# Altium project PROJECT-ESP32-S3-WROOM-1-BREAKOUT.PrjPcb
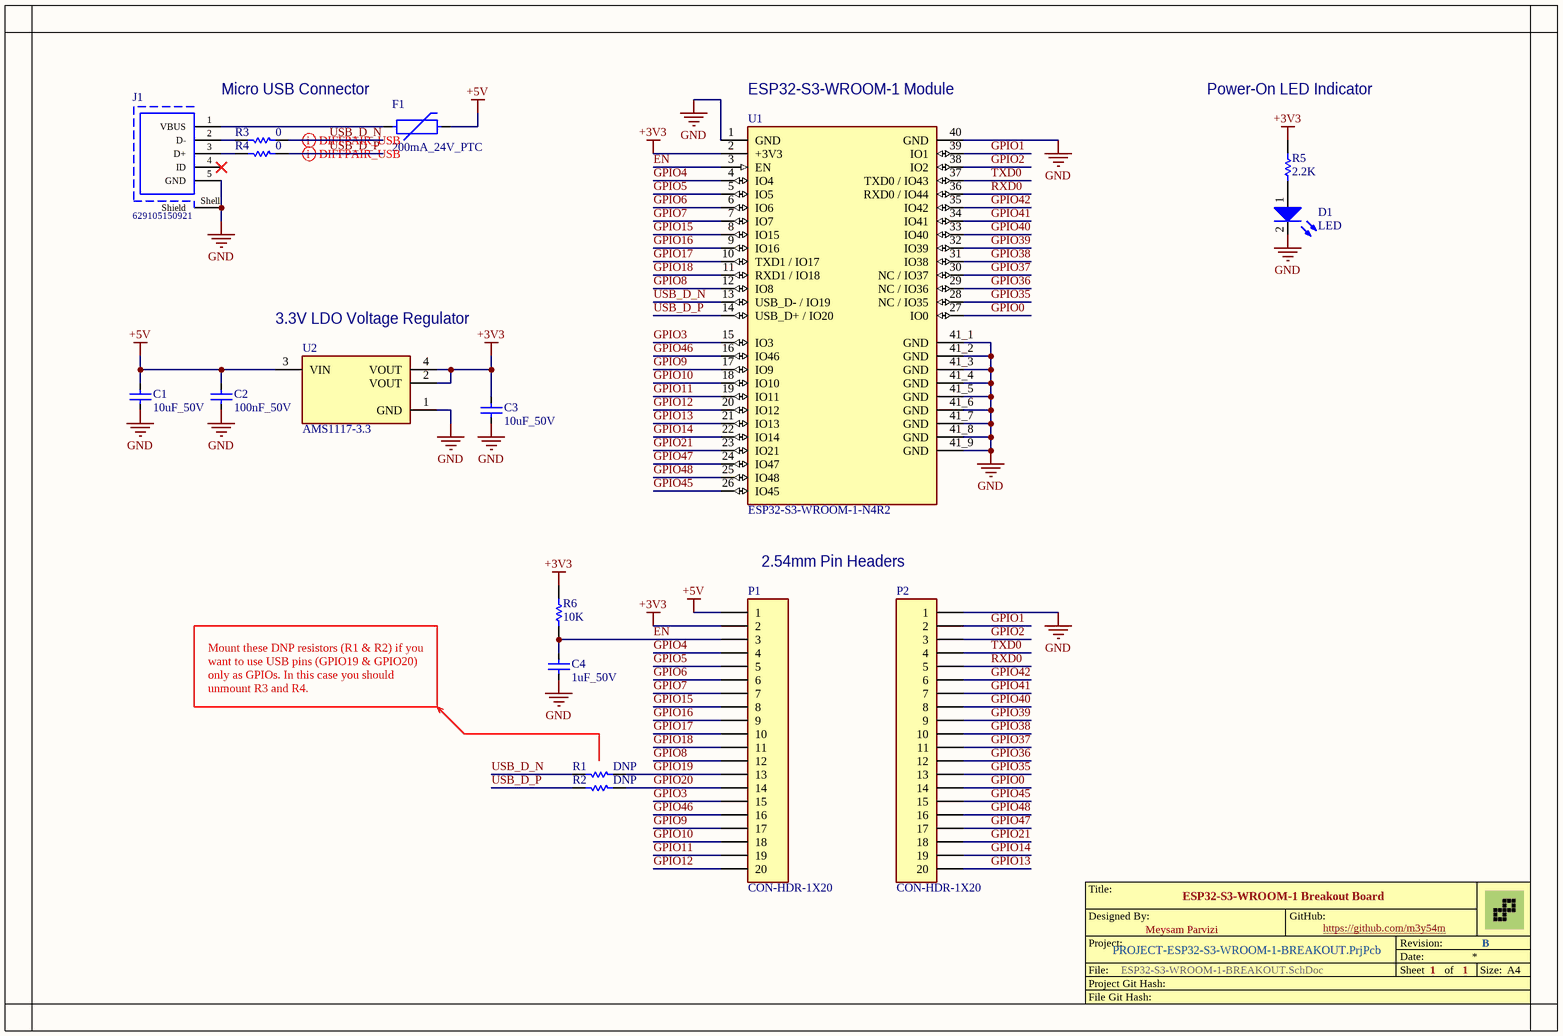
[diagram p0: ESP32-S3-WROOM-1-BREAKOUT.SchDoc]
1 sheet, 17 parts. Net scope: global (net labels, ports and power ports of the same name join across sheets).
Board file: ESP32-S3-WROOM-1-BREAKOUT.PcbDoc

## Sheet ESP32-S3-WROOM-1-BREAKOUT.SchDoc: ESP32-S3-WROOM-1 Breakout Board
size A4; Author: Meysam Parvizi; DrawnBy: Meysam Parvizi; Revision: B; SheetNumber: 1; SheetTotal: 1

### Parts
C1  value 10uF_50V  [C0805]  (hidden comment: C0805C104K5RAC7411)
C2  value 100nF_50V  [C0805]  (hidden comment: C0805C104K5RAC7411)
C3  value 10uF_50V  [C0805]  (hidden comment: C0805C104K5RAC7411)
C4  value 1uF_50V  [C0805]  (hidden comment: C0805C104K5RAC7411)
D1  LED  [LED0805]
F1  value 200mA_24V_PTC  [R1206]  (hidden comment: NANOSMDC020F-2)
J1  629105150921  [CON-MICRO-USB-B-SMD-WITH-HOLDER]
P1  CON-HDR-1X20  [CON-HDR-1X20-2.54]
P2  CON-HDR-1X20  [CON-HDR-1X20-2.54]
R1  value DNP  [R0603]  (hidden comment: CRG0805F10K)
R2  value DNP  [R0603]  (hidden comment: CRG0805F10K)
R3  value 0  [R0603]  (hidden comment: CRG0805F10K)
R4  value 0  [R0603]  (hidden comment: CRG0805F10K)
R5  value 2.2K  [R0805]  (hidden comment: CRG0805F10K)
R6  value 10K  [R0805]  (hidden comment: CRG0805F10K)
U1  ESP32-S3-WROOM-1-N4R2  [ESP32-S3-WROOM-1_NO-KEEPOUT]
U2  AMS1117-3.3  [SOT-223]

### Nets
+3V3: C3.1 P1.2 R5.1 R6.2 U1.2(+3V3) U2.2(VOUT) U2.4(VOUT)
+5V: C1.1 C2.1 F1.2 P1.1 U2.3(VIN)
GND: C1.2 C2.2 C3.2 C4.2 D1.2(K) J1.5(GND) J1.Shell(Shield) P2.1 U1.1(GND) U1.40(GND) U1.41_1(GND) U1.41_2(GND) U1.41_3(GND) U1.41_4(GND) U1.41_5(GND) U1.41_6(GND) U1.41_7(GND) U1.41_8(GND) U1.41_9(GND) U2.1(GND)
EN: C4.1 P1.3 R6.1 U1.3(EN)
GPIO0: P2.14 U1.27(IO0)
GPIO1: P2.2 U1.39(IO1)
GPIO2: P2.3 U1.38(IO2)
GPIO3: P1.15 U1.15(IO3)
GPIO4: P1.4 U1.4(IO4)
GPIO5: P1.5 U1.5(IO5)
GPIO6: P1.6 U1.6(IO6)
GPIO7: P1.7 U1.7(IO7)
GPIO8: P1.12 U1.12(IO8)
GPIO9: P1.17 U1.17(IO9)
GPIO10: P1.18 U1.18(IO10)
GPIO11: P1.19 U1.19(IO11)
GPIO12: P1.20 U1.20(IO12)
GPIO13: P2.20 U1.21(IO13)
GPIO14: P2.19 U1.22(IO14)
GPIO15: P1.8 U1.8(IO15)
GPIO16: P1.9 U1.9(IO16)
GPIO17: P1.10 U1.10(TXD1_/_IO17)
GPIO18: P1.11 U1.11(RXD1_/_IO18)
GPIO19: P1.13 R1.1
GPIO20: P1.14 R2.1
GPIO21: P2.18 U1.23(IO21)
GPIO35: P2.13 U1.28(NC_/_IO35)
GPIO36: P2.12 U1.29(NC_/_IO36)
GPIO37: P2.11 U1.30(NC_/_IO37)
GPIO38: P2.10 U1.31(IO38)
GPIO39: P2.9 U1.32(IO39)
GPIO40: P2.8 U1.33(IO40)
GPIO41: P2.7 U1.34(IO41)
GPIO42: P2.6 U1.35(IO42)
GPIO45: P2.15 U1.26(IO45)
GPIO46: P1.16 U1.16(IO46)
GPIO47: P2.17 U1.24(IO47)
GPIO48: P2.16 U1.25(IO48)
RXD0: P2.5 U1.36(RXD0_/_IO44)
TXD0: P2.4 U1.37(TXD0_/_IO43)
USB_D_N: R1.2 R3.1 U1.13(USB_D-_/_IO19)
USB_D_P: R2.2 R4.1 U1.14(USB_D+_/_IO20)
NetD1_1: D1.1(A) R5.2
NetF1_1: F1.1 J1.1(VBUS)
NetJ1_2: J1.2(D-) R3.2
NetJ1_3: J1.3(D+) R4.2

Not connected (* = marked no-connect by the designer): J1 4(ID)*

### Layout directives
differential pair; differential pair class USB: USB_D_N, USB_D_P

### Notes on the sheet
- Micro USB Connector
- (near U1) ESP32-S3-WROOM-1 Module
- Power-On LED Indicator
- (near U2) 3.3V LDO Voltage Regulator
- 2.54mm Pin Headers
- Mount these DNP resistors (R1 & R2) if you want to use USB pins (GPIO19 & GPIO20) only as GPIOs. In this case you should unmount R3 and R4.
- Title:
- Designed By:
- Meysam Parvizi
- GitHub:
- https://github.com/m3y54m
- File:
- Project Git Hash:
- Project:
- Date:
- Sheet
- Revision:
- of
- Size:
- A4
- File Git Hash:

### Library data of the parts
C1-C4 = CAPACITOR: C0805 0.10 μF X7R 30ppm/°C 10.00% 50 V; Manufacturer: KEMET; Material: Ceramic; Tolerance: 0.1; Capacitance: 100nF; Voltage Rating: 50 V; Temperature: -55°C to +125°C; Device Class L3: Ceramic Capacitors; Temperature Characteristic: X7R; Device Class L1: Passive Components; Category: Cap; Temperature Coefficient: 30ppm/°C; Manufacturer Part Number: C0805C104K5RAC7411; Temperature Range High: +125°C; Height: 0.88mm; RoHS: TRUE; ComponentLink2Description: Datasheet; Lead Free: Yes; Package: C0805C-DN; Temperature Range Low: -55°C; ComponentLink2URL: https://content.kemet.com/datasheets/KEM_C1003_C0G_SMD.pdf; Automotive: No; Ipc Land Pattern Name: CAPC200125X78; Octopart: https://octopart.com/c0805c104k5rac7411-kemet-18508045; Device Class L2: Capacitors
D1 = LED: Typical LED
F1 = FUSE-PTC: FUSE PPTC 200MA (1206) 24V RESETTABLE
J1 = CON-MICRO-USB-AB-RCPT-SMD: Micro USB 2.0 Type AB Receptacle WR-COM, Horizontal, SMT; Manufacturer: Wurth Elektronik; Rated Current: 1.8A; Contact Resistance: 30mOhm; Working Voltage: 30VAC; Publisher: WurthElektronik; Part Number: 629105150921; Operating Temperature: -40to85degC; Gender: Receptacle; Packaging: TapeandReel; Connector Type: MicroUSB2.0TypeAB; Datasheet URL: https://katalog.we-online.de/em/datasheet/629105150921.pdf; Mounting Technology: SMT; Orientation: Horizontal; Package Reference: 629105150921; Manufacturer URL: http://www.we-online.de
P1 P2 = CON-HDR-1X20: Pin Header, 20-Pin; LatestRevisionDate: 17-Jul-2002; LatestRevisionNote: Re-released for DXP Platform.; Publisher: Altium Limited
R1-R6 = RESISTOR: RES SMD 10K OHM 1% 1/8W 0805; Temperature Coefficient: 100ppm/°C; Power Rating: 125mW; Voltage Rating: 150V; Number of Resistors: 1; RoHS Compliant: Yes; Tolerance: 1%; Mount: Surface Mount; Radiation Hardening: No; Depth: 1.25mm; Termination: Solder; Series: CRG Series; Packaging: Tape and Reel; Number of Terminations: 2; Resistor Type: Thick Film; Length: 2mm; Height: 0.55mm; ELV: Compliant; Case/Package: 0805; Min Operating Temperature: -55°C; Max Operating Temperature: 125°C; Technology: THICK FILM
U1 = ESP32-S3-WROOM-1: Multiprotocol Modules SMD Module, ESP32-S3R8, 3.3V, 8 MB Octal PSRAM Die, 16 MB Quad SPI Flash, PCB Antenna; MPN: ESP32-S3-WROOM-1-N16R2; MF: Espressif Systems; Supplier Link: https://www.digikey.com/en/products/detail/espressif-systems/ESP32-S3-WROOM-1-N16R2/16162644; Package: Module Espressif Systems; Value: *; Digi-Key_Part_Number: 1965-ESP32-S3-WROOM-1-N16R2TR-ND; Check_prices: https://www.snapeda.com/parts/ESP32-WROOM-32/Espressif+Systems/view-part/?ref=eda; SnapEDA_Link: https://www.snapeda.com/parts/ESP32-WROOM-32/Espressif+Systems/view-part/?ref=snap; Price: 3.98; Supplier: Digikey
U2 = LD1117: IC REG LINEAR 3.3V 800MA SOT223; Input Bias Current: 5mA; Output Voltage Accuracy: 1%; Dropout Voltage: 1.1V; Power Dissipation: 12W; Polarity: Positive; Min Input Voltage: 5.3V; Quiescent Current: 10mA; Max Output Current: 1.3A; Output Current: 950mA; Number of Regulators: 1; Max Supply Voltage: 15V; Output Type: Fixed; Output Voltage: 3.3V; Number of Terminals: 4; Min Supply Voltage: 3.3V; Termination: SMD/SMT; Mount: Surface Mount; Max Power Dissipation: 12W; Case/Package: SOT-223; Lead Free: Lead Free; Height: 1.8mm; REACH SVHC: No SVHC; Radiation Hardening: No; Width: 3.5mm; Length: 6.5mm; Packaging: Tape and Reel; Max Input Voltage: 15V; Accuracy: 1%; Weight: 0.01lb; Contact Plating: Tin; Max Operating Temperature: 125°C; Number of Pins: 4; Max Output Voltage: 3.3V; Min Operating Temperature: -40°C; Nominal Output Voltage: 3.3V; Package Quantity: 1; Min Output Voltage: 3.3V; Number of Outputs: 1